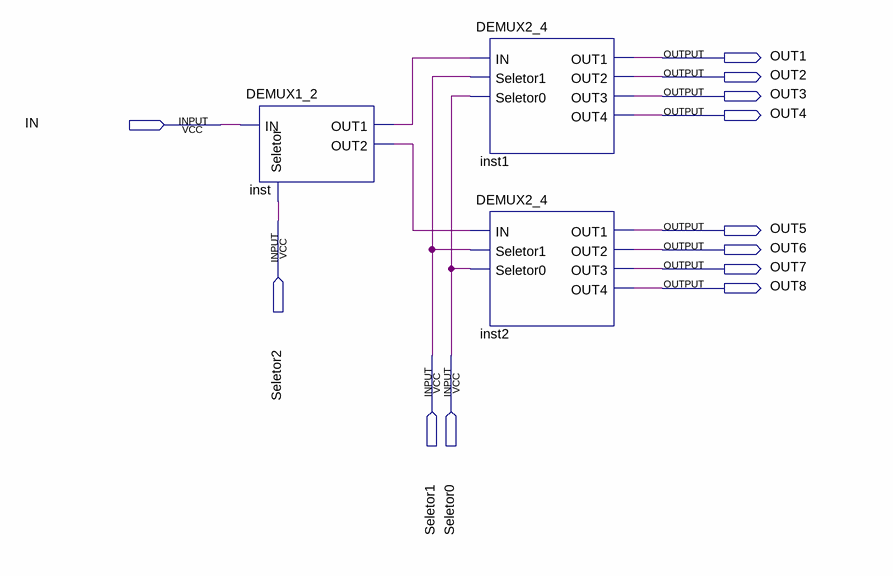
[diagram p0: schematic sheet]
// Quartus schematic DEMUX3_8.bdf as structural Verilog: 3 symbols, 12 pins
module DEMUX3_8 (
  input  IN,
  input  Seletor2,
  input  Seletor1,
  input  Seletor0,
  output OUT1,
  output OUT2,
  output OUT3,
  output OUT4,
  output OUT5,
  output OUT6,
  output OUT7,
  output OUT8
);

  wire inst_out1, inst_out2;

  DEMUX1_2 inst (.IN(IN), .Seletor(Seletor2), .OUT1(inst_out1), .OUT2(inst_out2));
  DEMUX2_4 inst1 (
    .IN(inst_out1), .Seletor1(Seletor1), .Seletor0(Seletor0), .OUT1(OUT1), .OUT2(OUT2), .OUT3(OUT3),
    .OUT4(OUT4));
  DEMUX2_4 inst2 (
    .IN(inst_out2), .Seletor1(Seletor1), .Seletor0(Seletor0), .OUT1(OUT5), .OUT2(OUT6), .OUT3(OUT7),
    .OUT4(OUT8));
endmodule
